# Altium schematic sheet Sche_1.SchDoc
size A
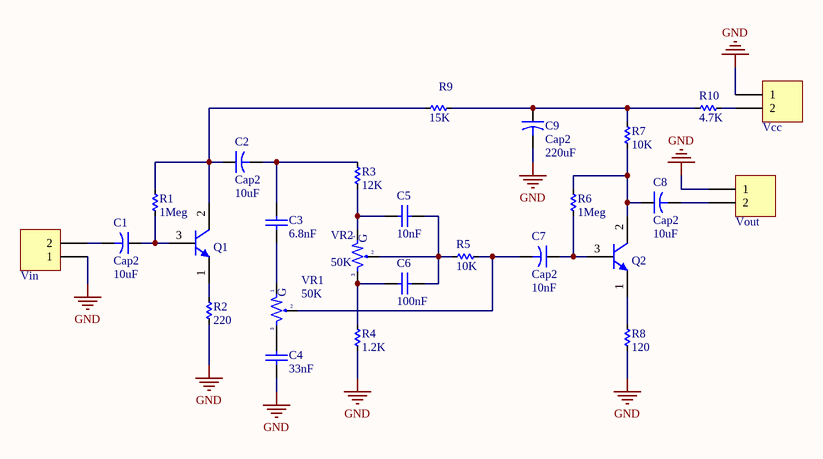
[diagram p0: Sche_1.SchDoc]

## Parts
C1  Cap2  value 10uF  [CAPR5-4X5]
C2  Cap2  value 10uF  [CAPR5-4X5]
C3  value 6.8nF  [CN1.5]  (hidden comment: Cap Non-Pol)
C4  value 33nF  [CN1.5]  (hidden comment: Cap Non-Pol)
C5  value 10nF  [CN1.5]  (hidden comment: Cap Non-Pol)
C6  value 100nF  [CN1.5]  (hidden comment: Cap Non-Pol)
C7  Cap2  value 10nF  [CAPR5-4X5]
C8  Cap2  value 10uF  [CAPR5-4X5]
C9  Cap2  value 220uF  [CAPR5-4X5]
Q1  C1815  [QTO-92]  (value not drawn)
Q2  C1815  [QTO-92]  (value not drawn)
R1  1Meg  [RES-1/4W]
R2  220  [RES-1/4W]
R3  12K  [RES-1/4W]
R4  1.2K  [RES-1/4W]
R5  10K  [RES-1/4W]
R6  1Meg  [RES-1/4W]
R7  10K  [RES-1/4W]
R8  120  [RES-1/4W]
R9  15K  [RES-1/4W]
R10  4.7K  [RES-1/4W]
Vcc  Domino 2  [DOMINO 2- 5mm]  (value not drawn)
Vin  Domino 2  [DOMINO 2- 5mm]  (value not drawn)
Vout  Domino 2  [DOMINO 2- 5mm]  (value not drawn)
VR1  50K  [VR-S1]
VR2  50K  [VR-S1]

## Nets
GND: C4.1 C9.2 R2.2 R4.2 R8.2 Vcc.1 Vin.1 Vout.1
NetC1_1: C1.1 Q1.3(B) R1.2
NetC1_2: C1.2 Vin.2
NetC2_1: C2.1 Q1.2(C) R1.1 R9.2
NetC2_2: C2.2 C3.2 R3.1
NetC3_1: C3.1 VR1.1
NetC4_2: C4.2 VR1.3
NetC5_1: C5.1 R3.2 VR2.1
NetC5_2: C5.2 C6.2 R5.2 VR2.2
NetC6_1: C6.1 R4.1 VR2.3
NetC7_1: C7.1 Q2.3(B) R6.2
NetC7_2: C7.2 R5.1 VR1.2
NetC8_1: C8.1 Q2.2(C) R6.1 R7.2
NetC8_2: C8.2 Vout.2
NetC9_1: C9.1 R7.1 R9.1 R10.2
NetQ1_1: Q1.1(E) R2.1
NetQ2_1: Q2.1(E) R8.1
NetR10_1: R10.1 Vcc.2

## Notes on the sheet
- (in symbol VR-S) G

## Library data of the parts
C1 C2 C7-C9 = Cap2: Capacitor; Published: 23-Sep-2002; PackageReference: CAPR5-4X5; Publisher: Altium Limited; PackageDescription: Capacitor; 2 Leads
C3-C6 = Cap Non-Pol: Capacitor
Q1 Q2 = C1815: NPN Bipolar Transistor
R1-R10 = Res: Manufacturer: Generic Components; Class: Passive; SubClass: R; Published: 08/06/2000; Publisher: Altium Hobart Technology Centre
Vcc Vin Vout = Domino 2: Domino, 2-Pin; LatestRevisionDate: 17-Jul-2002; LatestRevisionNote: Re-released for DXP Platform.; Publisher: Altium Limited
VR1 VR2 = VR-S: Var Resistor; Value: Volume 50k